# Altium schematic sheet Key_Reset.SchDoc
size 63 x 63 mm
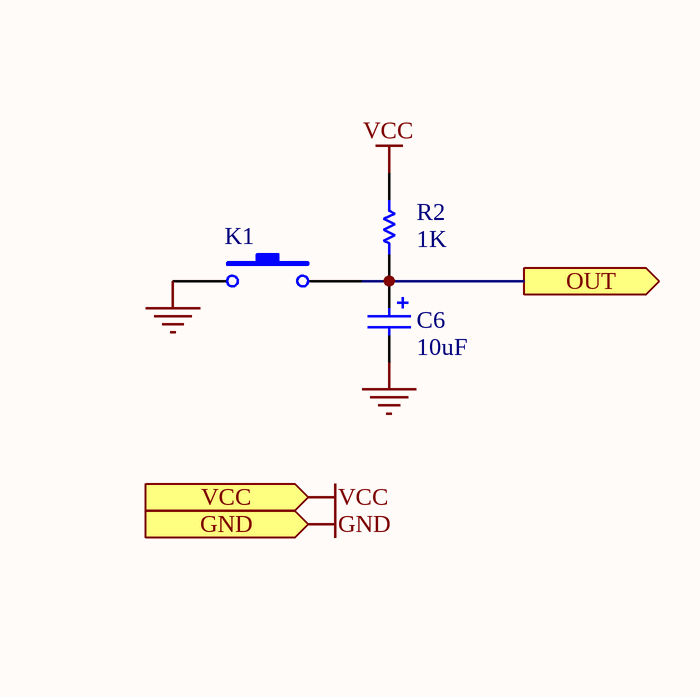
[diagram p0: Key_Reset.SchDoc]

## Parts
C6  value 10uF  [CAPPR2.5-6.3x5]  (hidden comment: Capacitor)
K1  SW-PB  [SPST-2_2]  (value not drawn)
R2  value 1K  [AXIAL-0.4]  (hidden comment: Res1)

## Ports
GND (in), OUT (out), VCC (in)

## Nets
GND: C6.2 K1.1 ; port GND
VCC: R2.1 ; port VCC
OUT: C6.1 K1.2 R2.2 ; port OUT

## Library data of the parts
C6 = Cap Pol1: Polarized Capacitor (Radial); Manufacturer: Generic Components; Class I: Passive; Published: 8-Jun-2000; Revision: July-2002: Re-released for DXP Platform.; Publisher: Altium Limited; Class II: Capacitor
K1 = SW-PB: Switch; Manufacturer: Generic Components; Published: 24-Mar-1999; Revision: July-2002: Re-released for DXP Platform.; Publisher: Altium Limited
R2 = Res1: Resistor; Manufacturer: Generic Components; Class I: Passive; Published: 8-Jun-2000; Revision: July-2002: Re-released for DXP Platform.; Publisher: Altium Limited; Class II: Resistor